# Altium schematic sheet Revisies.SchDoc
size A4; CompanyName: Ultimaker; Revision: rev. 2.0.2
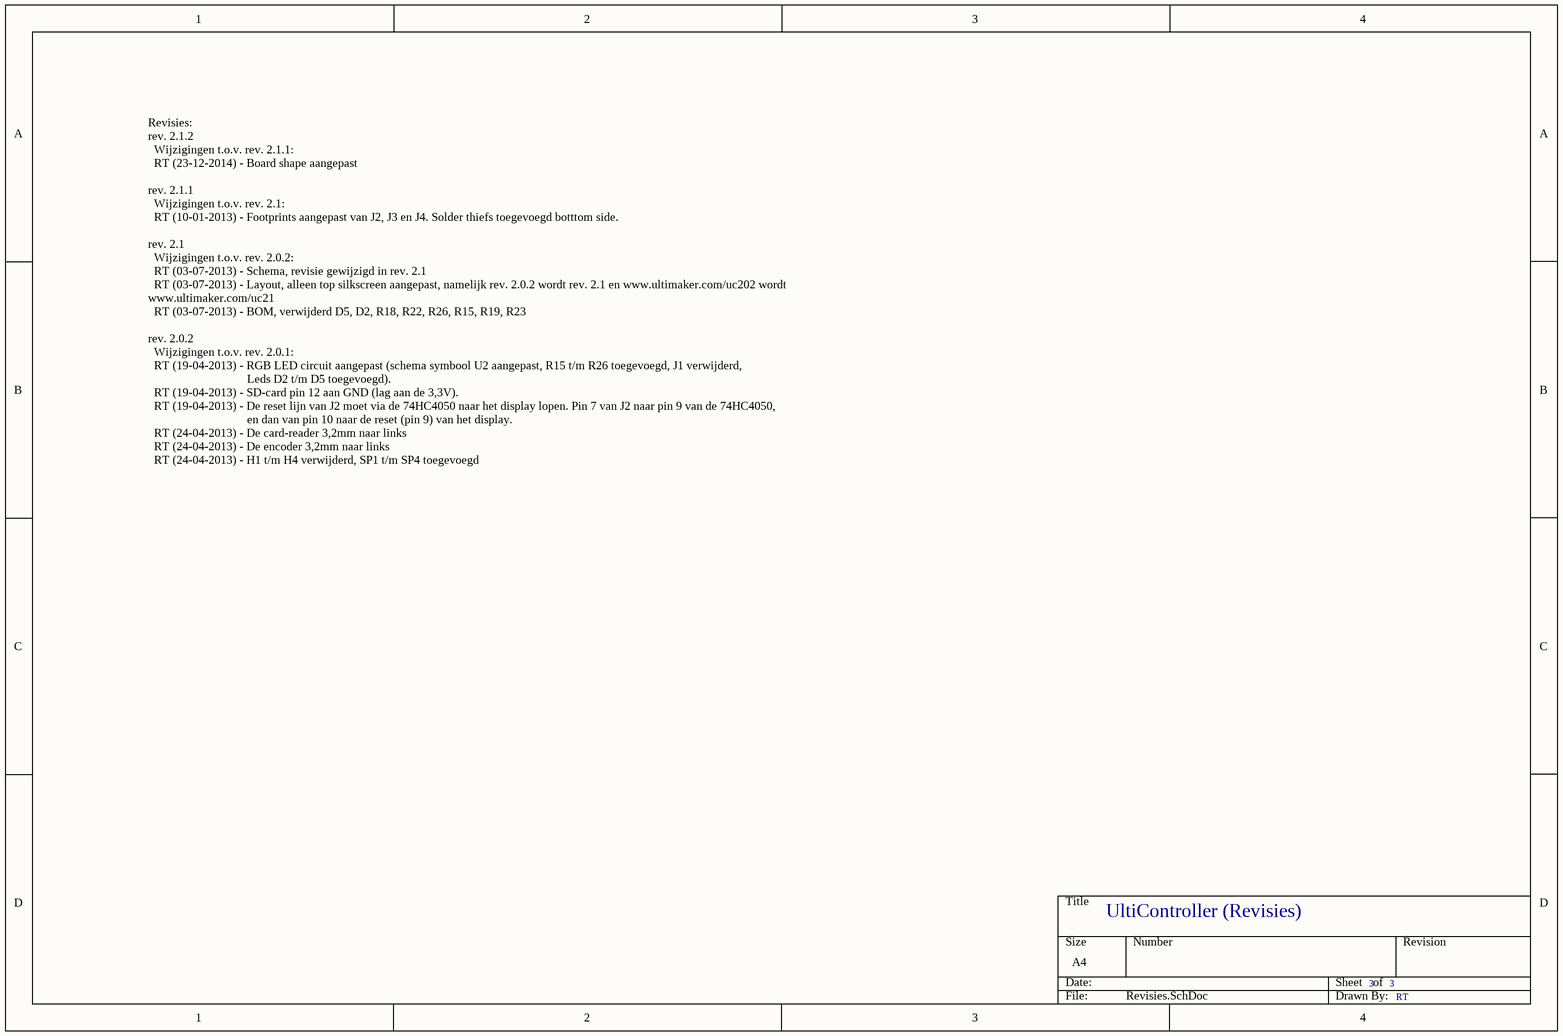
[diagram p0: Revisies.SchDoc]

## Notes on the sheet
- Revisies:
  rev. 2.1.2
  Wijzigingen t.o.v. rev. 2.1.1:
  RT (23-12-2014) - Board shape aangepast
  rev. 2.1.1
  Wijzigingen t.o.v. rev. 2.1:
  RT (10-01-2013) - Footprints aangepast van J2, J3 en J4. Solder thiefs toegevoegd botttom side.
  rev. 2.1
  Wijzigingen t.o.v. rev. 2.0.2:
  RT (03-07-2013) - Schema, revisie gewijzigd in rev. 2.1
  RT (03-07-2013) - Layout, alleen top silkscreen aangepast, namelijk rev. 2.0.2 wordt rev. 2.1 en www.ultimaker.com/uc202 wordt                                      www.ultimaker.com/uc21
  RT (03-07-2013) - BOM, verwijderd D5, D2, R18, R22, R26, R15, R19, R23
  rev. 2.0.2
  Wijzigingen t.o.v. rev. 2.0.1:
  RT (19-04-2013) - RGB LED circuit aangepast (schema symbool U2 aangepast, R15 t/m R26 toegevoegd, J1 verwijderd,
  Leds D2 t/m D5 toegevoegd).
  RT (19-04-2013) - SD-card pin 12 aan GND (lag aan de 3,3V).
  RT (19-04-2013) - De reset lijn van J2 moet via de 74HC4050 naar het display lopen. Pin 7 van J2 naar pin 9 van de 74HC4050,
  en dan van pin 10 naar de reset (pin 9) van het display.
  RT (24-04-2013) - De card-reader 3,2mm naar links
  RT (24-04-2013) - De encoder 3,2mm naar links
  RT (24-04-2013) - H1 t/m H4 verwijderd, SP1 t/m SP4 toegevoegd
- UltiController (Revisies)
- 3
- RT